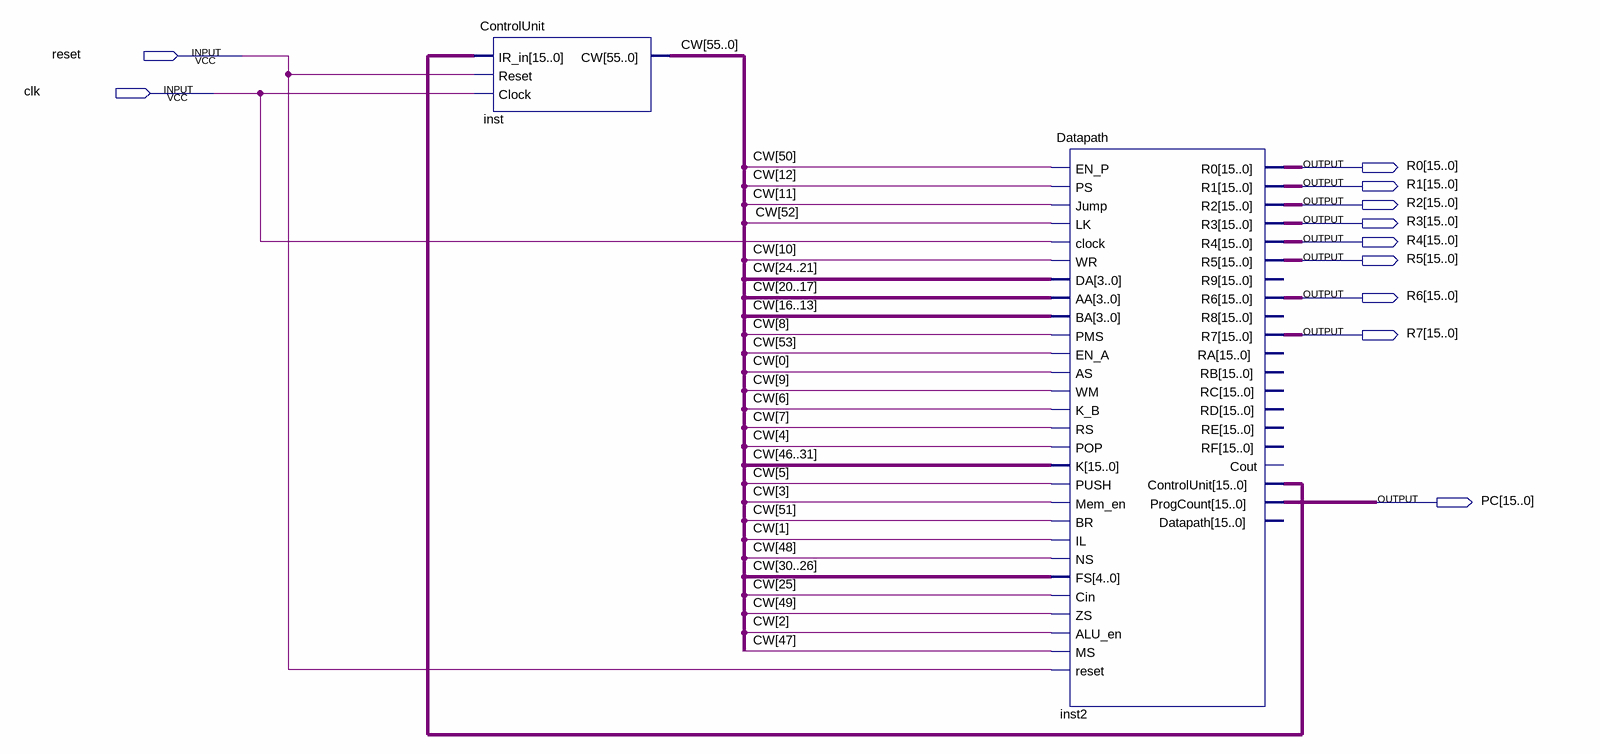
[diagram p0: schematic sheet]
// Quartus schematic CU_Datapath.bdf as structural Verilog: 2 symbols, 11 pins
module CU_Datapath (
  input  reset,
  input  clk,
  output [15:0] R0,
  output [15:0] R1,
  output [15:0] R2,
  output [15:0] R3,
  output [15:0] R4,
  output [15:0] R5,
  output [15:0] R6,
  output [15:0] R7,
  output [15:0] PC
);

  wire [15:0] inst2_controlunit;
  wire [55:0] CW;

  ControlUnit inst (.IR_in(inst2_controlunit), .Reset(reset), .Clock(clk), .CW(CW));
  Datapath inst2 (
    .EN_P(CW[50]), .PS(CW[12]), .Jump(CW[11]), .LK(CW[52]), .clock(clk), .WR(CW[10]), .DA(CW[24:21]),
    .AA(CW[20:17]), .BA(CW[16:13]), .PMS(CW[8]), .EN_A(CW[53]), .AS(CW[0]), .WM(CW[9]), .K_B(CW[6]),
    .RS(CW[7]), .POP(CW[4]), .K(CW[46:31]), .PUSH(CW[5]), .Mem_en(CW[3]), .BR(CW[51]), .IL(CW[1]),
    .NS(CW[48]), .FS(CW[30:26]), .Cin(CW[25]), .ZS(CW[49]), .ALU_en(CW[2]), .MS(CW[47]), .reset(reset),
    .R0(R0), .R1(R1), .R2(R2), .R3(R3), .R4(R4), .R5(R5), .R6(R6), .R7(R7), .ControlUnit(inst2_controlunit),
    .ProgCount(PC));  // open: R9, R8, RA, RB, RC, RD, RE, RF, Cout, Datapath
endmodule
